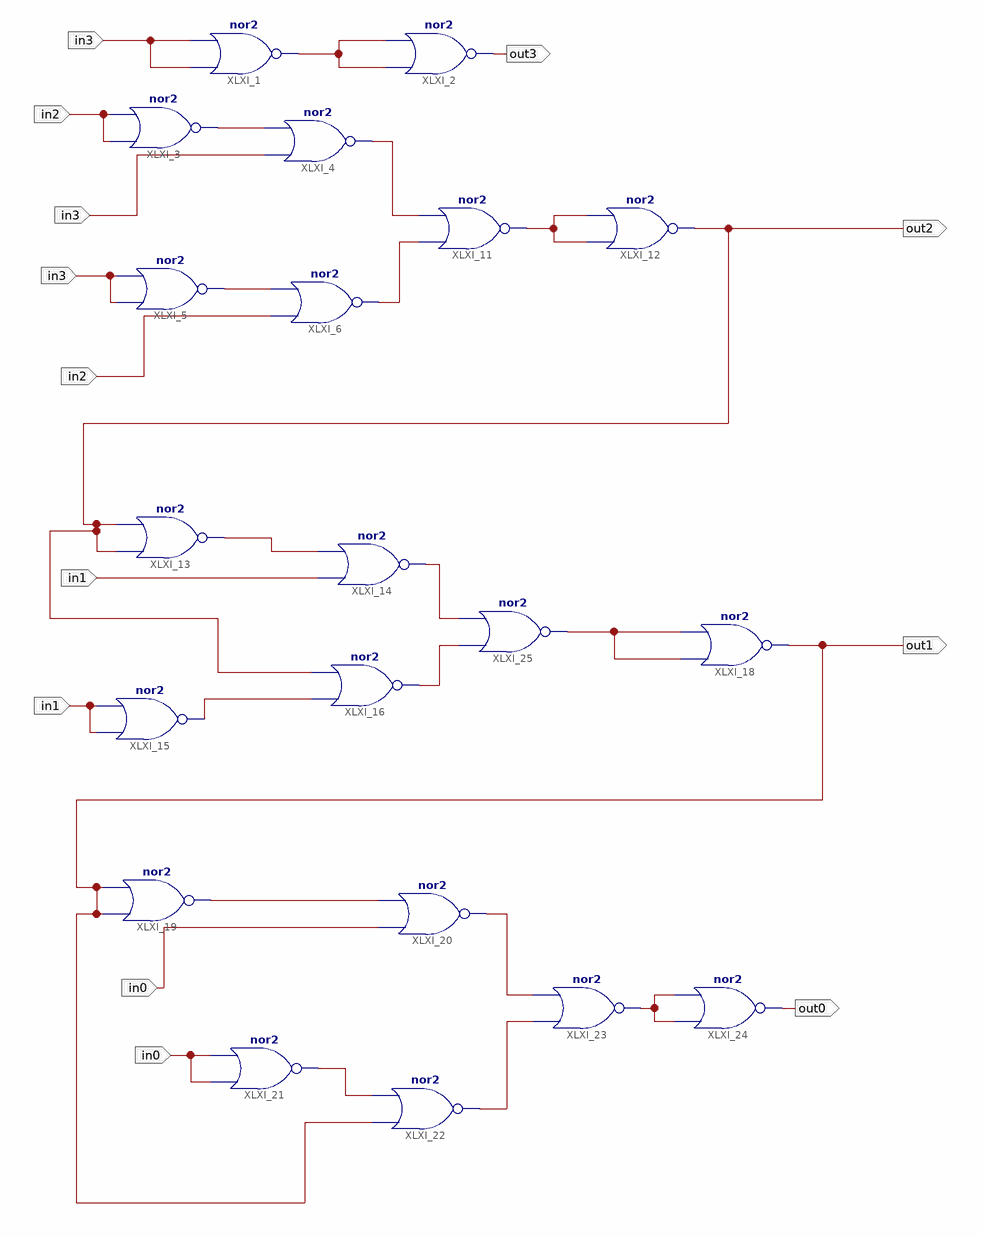
[diagram p0: schematic sheet 1]
// Xilinx ISE schematic Q1.sch (artix7) as structural Verilog: 20 symbols, 8 ports
module Q1 (
  input  in3,
  input  in2,
  input  in1,
  input  in0,
  output out3,
  output out2,
  output out0,
  output out1
);

  wire XLXN_1, XLXN_6, XLXN_10, XLXN_22, XLXN_23, XLXN_24, XLXN_29, XLXN_35, XLXN_45, XLXN_53, XLXN_55,
       XLXN_56, XLXN_57, XLXN_60, XLXN_61, XLXN_65;

  nor XLXI_1 (XLXN_1, in3, in3);
  nor XLXI_2 (out3, XLXN_1, XLXN_1);
  nor XLXI_3 (XLXN_6, in2, in2);
  nor XLXI_4 (XLXN_22, in3, XLXN_6);
  nor XLXI_5 (XLXN_10, in3, in3);
  nor XLXI_6 (XLXN_23, in2, XLXN_10);
  nor XLXI_11 (XLXN_24, XLXN_23, XLXN_22);
  nor XLXI_12 (out2, XLXN_24, XLXN_24);
  nor XLXI_13 (XLXN_29, out2, out2);
  nor XLXI_14 (XLXN_60, in1, XLXN_29);
  nor XLXI_16 (XLXN_61, XLXN_35, out2);
  nor XLXI_15 (XLXN_35, in1, in1);
  nor XLXI_19 (XLXN_45, out1, out1);
  nor XLXI_20 (XLXN_55, in0, XLXN_45);
  nor XLXI_21 (XLXN_53, in0, in0);
  nor XLXI_22 (XLXN_56, out1, XLXN_53);
  nor XLXI_23 (XLXN_57, XLXN_56, XLXN_55);
  nor XLXI_24 (out0, XLXN_57, XLXN_57);
  nor XLXI_25 (XLXN_65, XLXN_61, XLXN_60);
  nor XLXI_18 (out1, XLXN_65, XLXN_65);
endmodule
